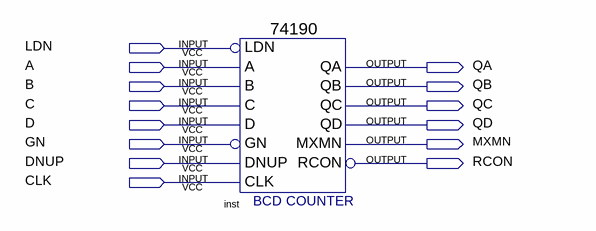
[diagram p0: schematic sheet]
// Quartus schematic 74190Test.bdf as structural Verilog: 1 symbols, 14 pins
module \74190Test  (
  input  LDN,
  input  A,
  input  B,
  input  C,
  input  D,
  input  GN,
  input  DNUP,
  input  CLK,
  output QA,
  output QB,
  output QC,
  output QD,
  output MXMN,
  output RCON
);

  \74190  inst (
    .LDN(LDN), .A(A), .C(C), .B(B), .D(D), .GN(GN), .CLK(CLK), .DNUP(DNUP), .QA(QA), .QB(QB), .QD(QD),
    .QC(QC), .MXMN(MXMN), .RCON(RCON));
endmodule
